# EAGLE schematic AT89S52-POV_Stick (EAGLE 7.5.0)
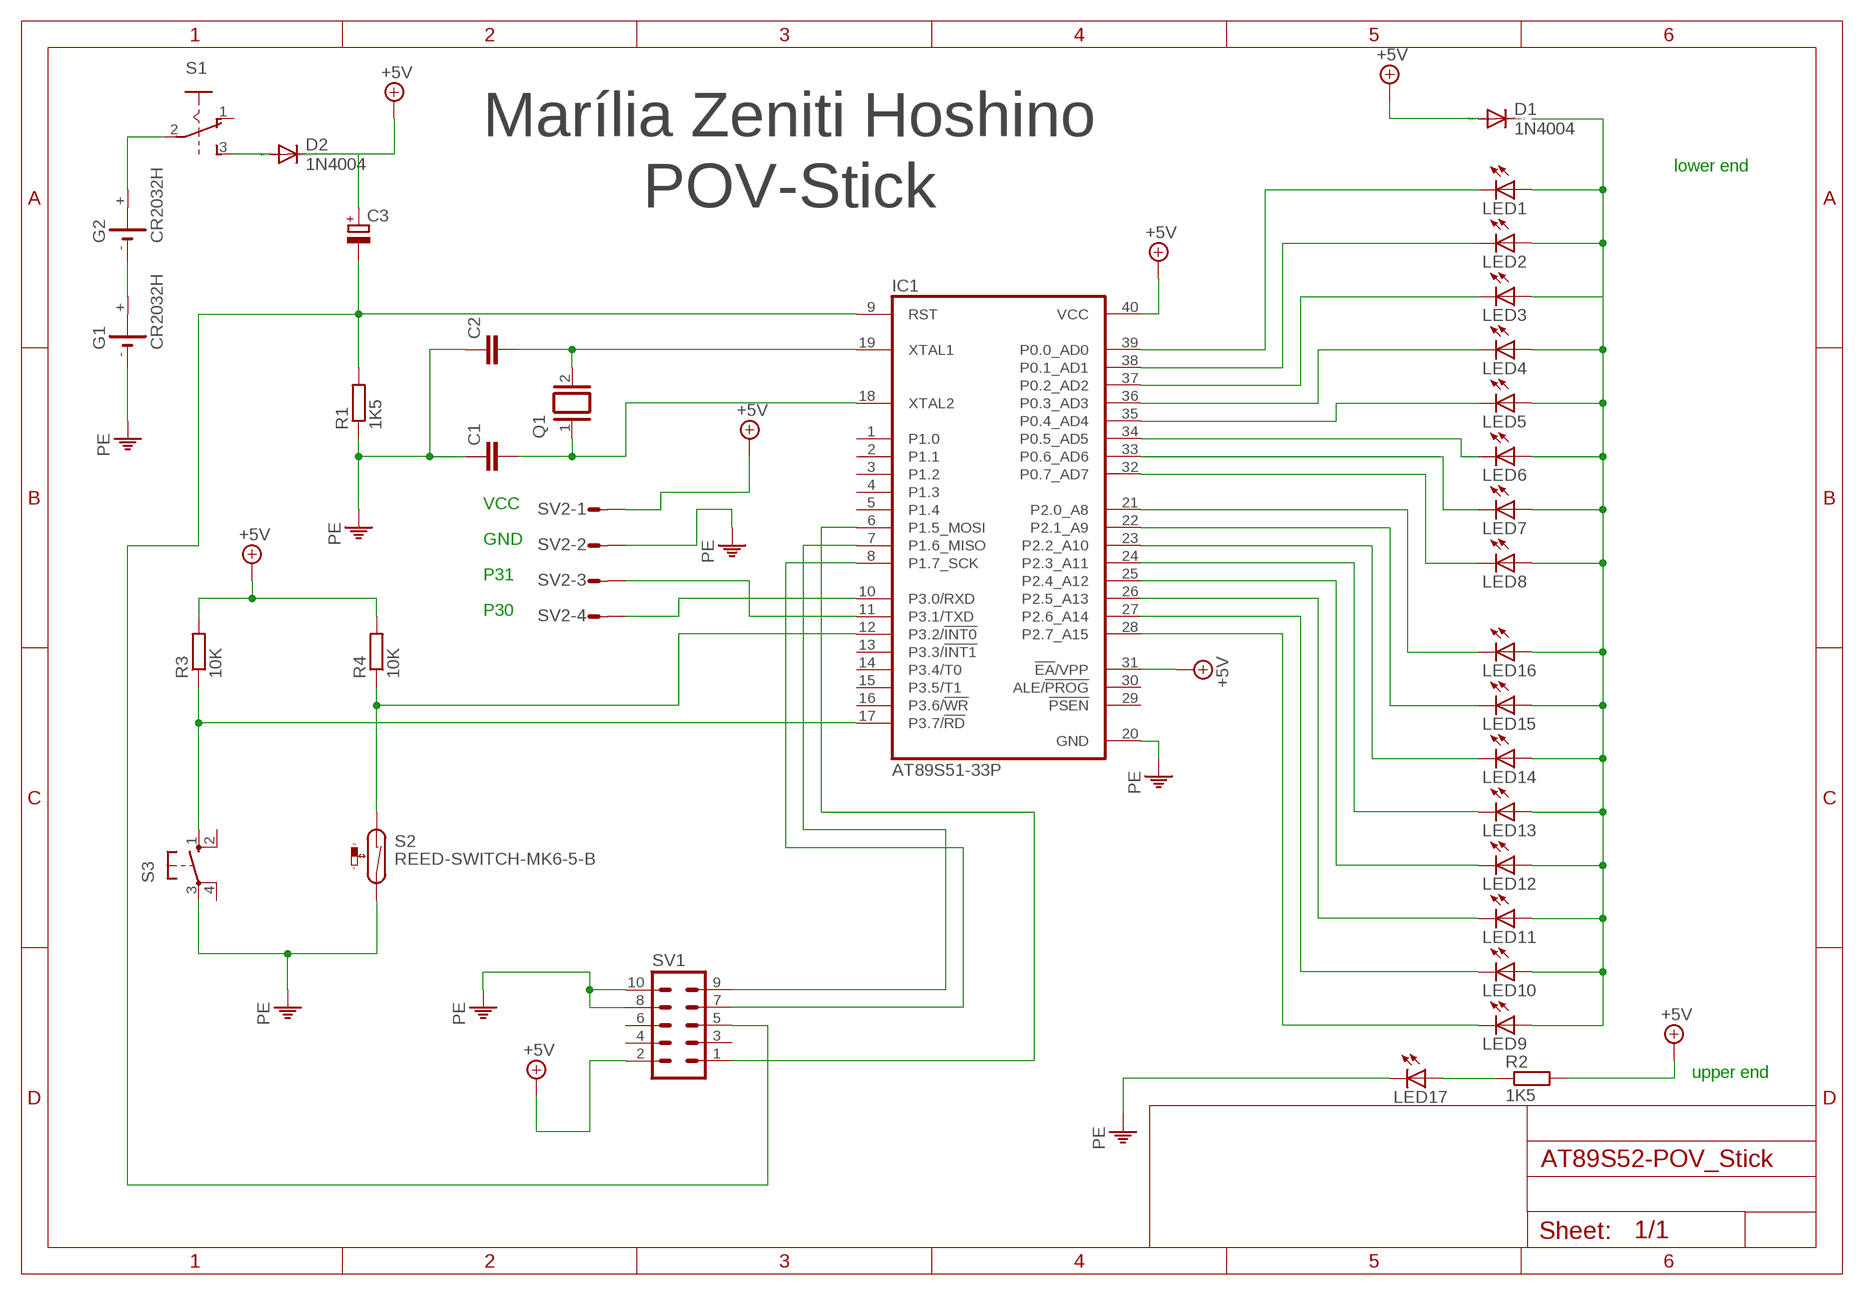
[diagram p0: schematic, sheet 1]

## Parts
C1  C-EU025-024X044  [C025-024X044]
C2  C-EU025-024X044  [C025-024X044]
C3  CPOL-EUE2-5  [E2-5]
D1  1N4004  [DO41-10]
D2  1N4004  [DO41-10]
G1  CR2032H  [CR2032H]
G2  CR2032H  [CR2032H]
IC1  AT89S51-33P  [DIL40]
LED1  LED5MM  [LED5MM]
LED2  LED5MM  [LED5MM]
LED3  LED5MM  [LED5MM]
LED4  LED5MM  [LED5MM]
LED5  LED5MM  [LED5MM]
LED6  LED5MM  [LED5MM]
LED7  LED5MM  [LED5MM]
LED8  LED5MM  [LED5MM]
LED9  LED5MM  [LED5MM]
LED10  LED5MM  [LED5MM]
LED11  LED5MM  [LED5MM]
LED12  LED5MM  [LED5MM]
LED13  LED5MM  [LED5MM]
LED14  LED5MM  [LED5MM]
LED15  LED5MM  [LED5MM]
LED16  LED5MM  [LED5MM]
LED17  LED5MM  [LED5MM]
Q1  XTAL/S  [QS]
R1  1K5  R-EU_0204/7  [0204/7]
R2  1K5  R-EU_0204/7  [0204/7]
R3  10K  R-EU_0204/7  [0204/7]
R4  10K  R-EU_0204/7  [0204/7]
S1  A68-A31  [A68-A31]
S2  REED-SWITCH-MK6-5-B  [MK6-5]
S3  10-XX  [B3F-10XX]
SV1  ML10  [ML10]
SV2  S04P  [S04P]

## Nets
+5V: C3.+ D1.A D2.C IC1.31(!EA!/VPP) IC1.40(VCC) R2.2 R3.2 R4.2 SV1.2 SV2.1
N$1: IC1.39(P0.0_AD0) LED1.K(C)
N$2: IC1.38(P0.1_AD1) LED2.K(C)
N$3: IC1.37(P0.2_AD2) LED3.K(C)
N$4: IC1.36(P0.3_AD3) LED4.K(C)
N$5: IC1.35(P0.4_AD4) LED5.K(C)
N$6: IC1.34(P0.5_AD5) LED6.K(C)
N$7: IC1.33(P0.6_AD6) LED7.K(C)
N$8: IC1.32(P0.7_AD7) LED8.K(C)
N$9: IC1.21(P2.0_A8) LED16.K(C)
N$10: IC1.22(P2.1_A9) LED15.K(C)
N$11: IC1.23(P2.2_A10) LED14.K(C)
N$12: IC1.24(P2.3_A11) LED13.K(C)
N$13: IC1.25(P2.4_A12) LED12.K(C)
N$14: IC1.26(P2.5_A13) LED11.K(C)
N$15: IC1.27(P2.6_A14) LED10.K(C)
N$16: IC1.28(P2.7_A15) LED9.K(C)
N$17: C2.2 IC1.19(XTAL1) Q1.2
N$18: C1.2 IC1.18(XTAL2) Q1.1
N$19: LED17.A R2.1
N$20: G1.+ G2.-
N$21: G2.+ S1.2(A:P)
N$22: D2.A S1.3(A:S)
N$24: IC1.17(P3.7/!RD) R3.1 S3.1(S)
N$25: IC1.12(P3.2/!INT0) R4.1 S2.1
N$26: LED1.A LED2.A LED3.A LED4.A LED5.A LED6.A LED7.A LED8.A LED9.A LED10.A LED11.A LED12.A LED13.A LED14.A LED15.A LED16.A
N$27: IC1.6(P1.5_MOSI) SV1.1
N$28: IC1.7(P1.6_MISO) SV1.9
N$29: IC1.8(P1.7_SCK) SV1.7
N$30: C3.- IC1.9(RST) R1.2 SV1.5
N$31: IC1.11(P3.1/TXD) SV2.3
N$32: IC1.10(P3.0/RXD) SV2.4
PE: C1.1 C2.1 G1.- IC1.20(GND) LED17.K(C) R1.1 S2.2 S3.3(P) SV1.8 SV1.10 SV2.2
Unconnected: D1.C G1.+@1(+) G2.+@1(+) IC1.1(P1.0) IC1.2(P1.1) IC1.3(P1.2) IC1.4(P1.3) IC1.5(P1.4) IC1.13(P3.3/!INT1) IC1.14(P3.4/T0) IC1.15(P3.5/T1) IC1.16(P3.6/!WR) IC1.29(!PSEN) IC1.30(ALE/!PROG) S1.1(A:O) S1.4(B:O) S1.5(B:P) S1.6(B:S) S3.2(S1) S3.4(P1) SV1.3 SV1.4 SV1.6

## Notes on the sheet
- Marília Zeniti Hoshino
- lower end
- POV-Stick
- VCC
- GND
- P31
- P30
- upper end

## Library data of the parts
C1 C2 = rcl:C-EU: CAPACITOR, European symbol
C3 = resistor:CPOL-EU: POLARIZED CAPACITOR, European symbol
D1 D2 = diode:1N4004: DIODE general purpose rectifier, 1 A
G1 G2 = battery:CR2032H: LI BATTERY Varta
IC1 = atmel:AT89S51-*: 8-bit Microcontroller with 4K BytesIn-System Programmable Flash Source: http://www.atmel.com/dyn/resources/prod_documents/doc2487.pdf; MPN: AT89S51-24PU; OC_FARNELL: 1095739; OC_NEWARK: 96K6578
LED1-LED17 = led:LED: LED OSRAM: - CHIPLED LG R971, LG N971, LY N971, LG Q971, LY Q971, LO R971, LY R971 LH N974, LH R974 LS Q976, LO Q976, LY Q976 LO Q996 - Hyper CHIPLED LW Q18S LB Q993, LB Q99A, LB R99A - SideLED LS A670, LO A670, LY A670, LG A670, LP A670 LB A673, LV A673, LT A673, LW A673 LH A674 LY A675 LS A676, LA A676, LO A676, LY A676, LW A676 LS A679, LY A679, LG A679 - Hyper Micro SIDELED® LS Y876, LA Y876, LO Y876, LY Y876 LT Y87S - SmartLED LW L88C, LW L88S LB L89C, LB L89S, LG L890 LS L89K, LO L89K, LY L89K LS L896, LA L896, LO L896, LY L896 - TOPLED LS T670, LO T670, LY T670, LG T670, LP T670 LSG T670, LSP T670, LSY T670, LOP T670, LYG T670 LG T671, LOG T671, LSG T671 LB T673, LV T673, LT T673, LW T673 LH T674 LS T676, LA T676, LO T676, LY T676, LB T676, LH T676, LSB T676, LW T676 LB T67C, LV T67C, LT T67C, LS T67K, LO T67K, LY T67K, LW E67C LS E67B, LA E67B, LO E67B, LY E67B, LB E67C, LV E67C, LT E67C LW T67C LS T679, LY T679, LG T679 LS T770, LO T770, LY T770, LG T770, LP T770 LB T773, LV T773, LT T773, LW T773 LH T774 LS E675, LA E675, LY E675, LS T675 LS T776, LA T776, LO T776, LY T776, LB T776 LHGB T686 LT T68C, LB T68C - Hyper Mini TOPLED® LB M676 - Mini TOPLED Santana® LG M470 LS M47K, LO M47K, LY M47K Source: http://www.osram.convergy.de LUXEON: - LUMILED® LXK2-PW12-R00, LXK2-PW12-S00, LXK2-PW14-U00, LXK2-PW14-V00 LXK2-PM12-R00, LXK2-PM12-S00, LXK2-PM14-U00 LXK2-PE12-Q00, LXK2-PE12-R00, LXK2-PE12-S00, LXK2-PE14-T00, LXK2-PE14-U00 LXK2-PB12-K00, LXK2-PB12-L00, LXK2-PB12-M00, LXK2-PB14-N00, LXK2-PB14-P00, LXK2-PB14-Q00 LXK2-PR12-L00, LXK2-PR12-M00, LXK2-PR14-Q00, LXK2-PR14-R00 LXK2-PD12-Q00, LXK2-PD12-R00, LXK2-PD12-S00 LXK2-PH12-R00, LXK2-PH12-S00 LXK2-PL12-P00, LXK2-PL12-Q00, LXK2-PL12-R00 Source: www.luxeon.com KINGBRIGHT: KA-3528ASYC Source: www.kingbright.com
Q1 = special:XTAL/S: CRYSTAL
R1-R4 = resistor:R-EU_: RESISTOR, European symbol
S1 = switch:A68-A31: SLIDING SWITCH Siemens, distributor Buerklin, 11G766
S2 = switch-reed:REED-SWITCH-: Reed Sensor; MF: MEDER; MPN: MK6-5-B; OC_FARNELL: 1079479
S3 = switch-omron:10-XX: OMRON SWITCH; MPN: B3F-1000; OC_FARNELL: 176432; OC_NEWARK: 36M3542
SV1 = con-harting-ml:ML10: HARTING; OC_FARNELL: unknown; OC_NEWARK: unknown
SV2 = con-amp-mt:S04P: AMP MT CONNECTOR; OC_FARNELL: unknown; OC_NEWARK: unknown